# EAGLE design abqmmf2018 (EAGLE 7.7.0)
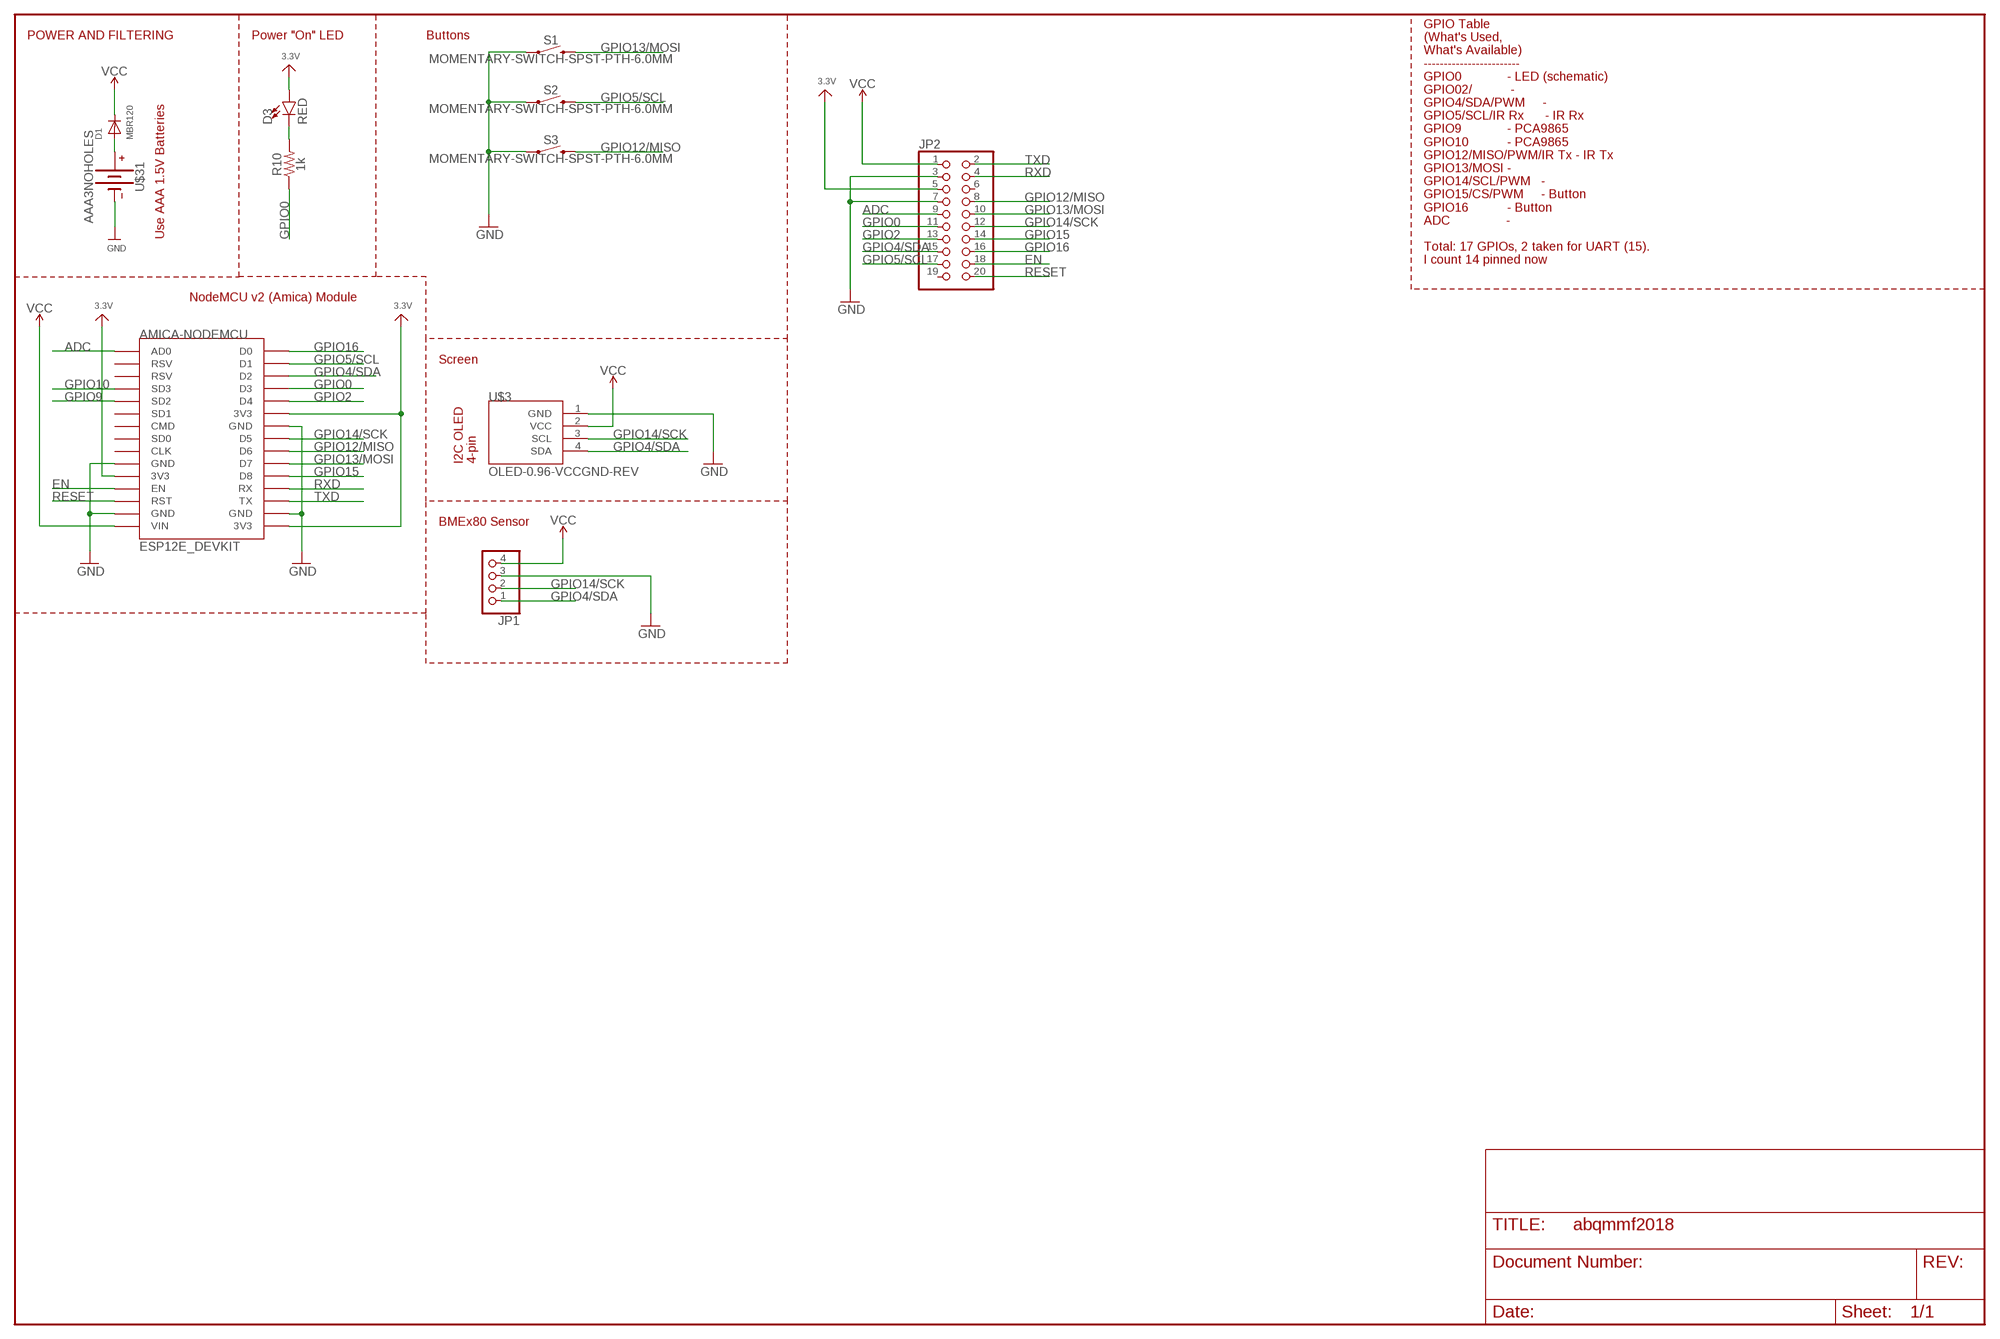
[diagram p0: schematic, sheet 1]

## Parts
AMICA-NODEMCU  ESP12E_DEVKIT  [ESP12E_DEVKIT]
D1  MBR120  DIODEDO-1N4148  [DO-1N4148]
D3  RED  LED5MM  [LED_5MM]
JP1  PINHD-1X4  [1X04]
JP2  PINHD-2X10  [2X10]
R10  1k  1KOHM-HORIZ-1/4W-1%  [AXIAL-0.3]
S1  MOMENTARY-SWITCH-SPST-PTH-6.0MM  [TACTILE_SWITCH_PTH_6.0MM]
S2  MOMENTARY-SWITCH-SPST-PTH-6.0MM  [TACTILE_SWITCH_PTH_6.0MM]
S3  MOMENTARY-SWITCH-SPST-PTH-6.0MM  [TACTILE_SWITCH_PTH_6.0MM]
U$3  OLED-0.96-VCCGND-REV  [OLED-I2C-4PIN-VCCGND-REV]
U$31  AAA3NOHOLES  [AAA3-NOHOLES]

## Nets
3.3V: AMICA-NODEMCU.3V3@0(3V3) AMICA-NODEMCU.3V3@1(3V3) AMICA-NODEMCU.3V3@2(3V3) D3.A JP2.5
ADC: AMICA-NODEMCU.AD0 JP2.9
EN: AMICA-NODEMCU.EN JP2.18
GND: AMICA-NODEMCU.GND@0(GND) AMICA-NODEMCU.GND@1(GND) AMICA-NODEMCU.GND@2(GND) AMICA-NODEMCU.GND@3(GND) JP1.3 JP2.3 JP2.7 S1.1 S2.1 S3.1 U$3.1(GND) U$31.NEG(-)
GPIO0: AMICA-NODEMCU.D3 JP2.11 R10.P$1
GPIO2: AMICA-NODEMCU.D4 JP2.13
GPIO4/SDA: AMICA-NODEMCU.D2 JP1.1 JP2.15 U$3.4(SDA)
GPIO5/SCL: AMICA-NODEMCU.D1 JP2.17 S2.3
GPIO9: AMICA-NODEMCU.SD2
GPIO10: AMICA-NODEMCU.SD3
GPIO12/MISO: AMICA-NODEMCU.D6 JP2.8 S3.3
GPIO13/MOSI: AMICA-NODEMCU.D7 JP2.10 S1.3
GPIO14/SCK: AMICA-NODEMCU.D5 JP1.2 JP2.12 U$3.3(SCL)
GPIO15: AMICA-NODEMCU.D8 JP2.14
GPIO16: AMICA-NODEMCU.D0 JP2.16
N$1: D1.A U$31.POS(+)
N$5: D3.K(C) R10.P$2
RESET: AMICA-NODEMCU.RST JP2.20
RXD: AMICA-NODEMCU.RX JP2.4
TXD: AMICA-NODEMCU.TX JP2.2
VCC: AMICA-NODEMCU.VIN D1.C JP1.4 JP2.1 U$3.2(VCC)
Unconnected: AMICA-NODEMCU.CLK AMICA-NODEMCU.CMD AMICA-NODEMCU.RSV@0(RSV) AMICA-NODEMCU.RSV@1(RSV) AMICA-NODEMCU.SD0 AMICA-NODEMCU.SD1 JP2.6 JP2.19

## Notes on the sheet
- POWER AND FILTERING | Power "On" LED | Buttons
- Use AAA 1.5V Batteries
- GPIO Table
  (What's Used,
  What's Available)
  ------------------------
  GPIO0             - LED (schematic)
  GPIO02/           - 
  GPIO4/SDA/PWM     -
  GPIO5/SCL/IR Rx      - IR Rx
  GPIO9             - PCA9865
  GPIO10           - PCA9865
  GPIO12/MISO/PWM/IR Tx - IR Tx
  GPIO13/MOSI - 
  GPIO14/SCL/PWM   - 
  GPIO15/CS/PWM     - Button
  GPIO16           - Button
  ADC                -
  
  Total: 17 GPIOs, 2 taken for UART (15). 
  I count 14 pinned now
- NodeMCU v2 (Amica) Module
- Screen
- BMEx80 Sensor

## Library data of the parts
AMICA-NODEMCU = ESP12E_DEVKIT:ESP12E_DEVKIT: ESP12E DEVKIT BOARD
D1 = adafruit:DIODE: Diode SMADIODE - SMA Surface Mount Package 20V 1A Schottky Diode Digikey: 641-1014-6-ND DO-1N4148 - Through Hole Small Current Diode SOD-123 20V 1 A (.5mV Vf) Schottky Diode - Digikey: MBRX120TPMSCT-ND SOD-323 10V 570mA (.38mV Vf, 3ns) Schottky Diode - Digikey: ZLLS410CT-ND SOD-523 30V 30mA Schottky Diode (RB751S-40TE61) - Digikey: RB751S-40TE61CT-ND SOT23-R/W - SOT23 Package (R = Solder Paste/Reflow Ovens, W = Hand-Soldering) BAT54Film 40V 300mA - Digikey: 497-7162-1-ND
D3 = SparkFun-LED:LED: LED (Generic) Standard schematic elements and footprints for 5mm, 3mm, 1206, and 0603 sized LEDs. Generic LEDs with no color specified.
JP1 = pinhead:PINHD-1X4: PIN HEADER
JP2 = pinhead:PINHD-2X10: PIN HEADER
R10 = SparkFun-Resistors:1KOHM: 1kΩ resistor A resistor is a passive two-terminal electrical component that implements electrical resistance as a circuit element. Resistors act to reduce current flow, and, at the same time, act to lower voltage levels within circuits. - Wikipedia; PROD_ID: RES-12182
S1-S3 = SparkFun-Switches:MOMENTARY-SWITCH-SPST: Momentary Switch (Pushbutton) - SPST Normally-open (NO) SPST momentary switches (buttons, pushbuttons). Variants PTH-12MM - 12mm square, through-hole Momentary Pushbutton Switch - 12mm Square <https://www.sparkfun.com/products/9190> (COM-09190) PTH-6.0MM, PTH-6.0MM-KIT - 6.0mm square, through-hole Mini Pushbutton Switch <https://www.sparkfun.com/products/97> (COM-00097) KIT package intended for soldering kit's - only one side of pads' copper is exposed. PTH-RIGHT-ANGLE-KIT - Right-angle, through-hole Right Angle Tactile Button <https://www.sparkfun.com/products/10791> - Used on SparkFun BigTime Watch Kit <https://www.sparkfun.com/products/11734> SMD-12MM - 12mm square, surface-mount Tactile Button - SMD (12mm) <https://www.sparkfun.com/products/12993> (COM-12993) Used on SparkFun PicoBoard <https://www.sparkfun.com/products/11888> SMD-4.5MM - 4.5mm Square Trackball Switch Used on SparkFun Blackberry Trackballer Breakout <https://www.sparkfun.com/products/13169> SMD-4.6MMX2.8MM - 4.60mm x 2.80mm, surface mount Used on SparkFun SAMD21 Mini Breakout <https://www.sparkfun.com/products/13664> SMD-5.2MM, SMD-5.2-REDUNDANT - 5.2mm square, surface-mount Mini Pushbutton Switch - SMD <https://www.sparkfun.com/products/8720> (COM-08720) Used on Arduino Pro Mini <https://www.sparkfun.com/products/11114> REDUNDANT package connects both switch circuits together SMD-6.0X3.5MM - 6.0 x 3.5mm, surface mount Momentary Reset Switch SMD <https://www.sparkfun.com/products/8229> (COM-08229) SMD-6.2MM-TALL - 6.2mm square, surface mount Tactile Button - SMD (6mm) <https://www.sparkfun.com/products/12992> Used on SparkFun Digital Sandbox <https://www.sparkfun.com/products/12651> SMD-RIGHT-ANGLE - Right-angle, surface mount Used on SparkFun Block for Intel® Edison - Arduino <https://www.sparkfun.com/products/13036>; PROD_ID: SWCH-08441; SF_SKU: COM-00097
U$3 = Warthog9-Screens:OLED-0.96-VCCGND-REV: Common 0.96 OLED screen assembly
U$31 = Warthog9-Batteries:AAA3

## Board
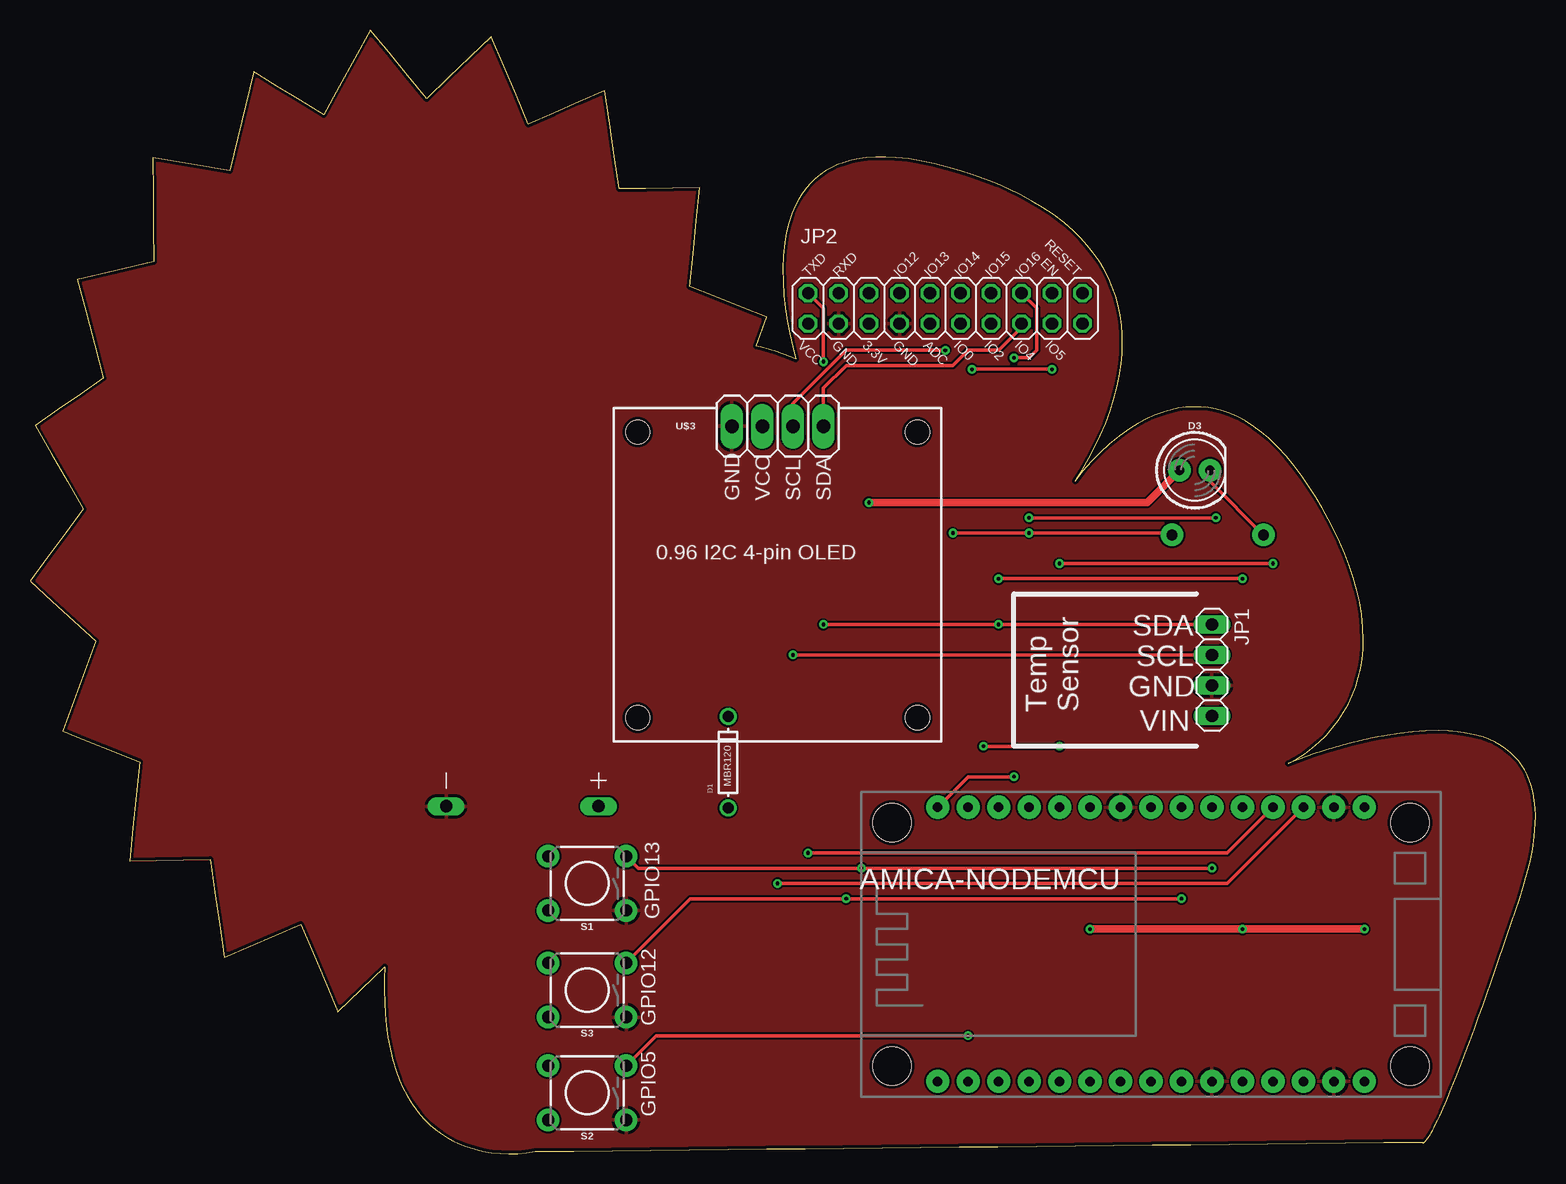
[diagram p1: board, top side]
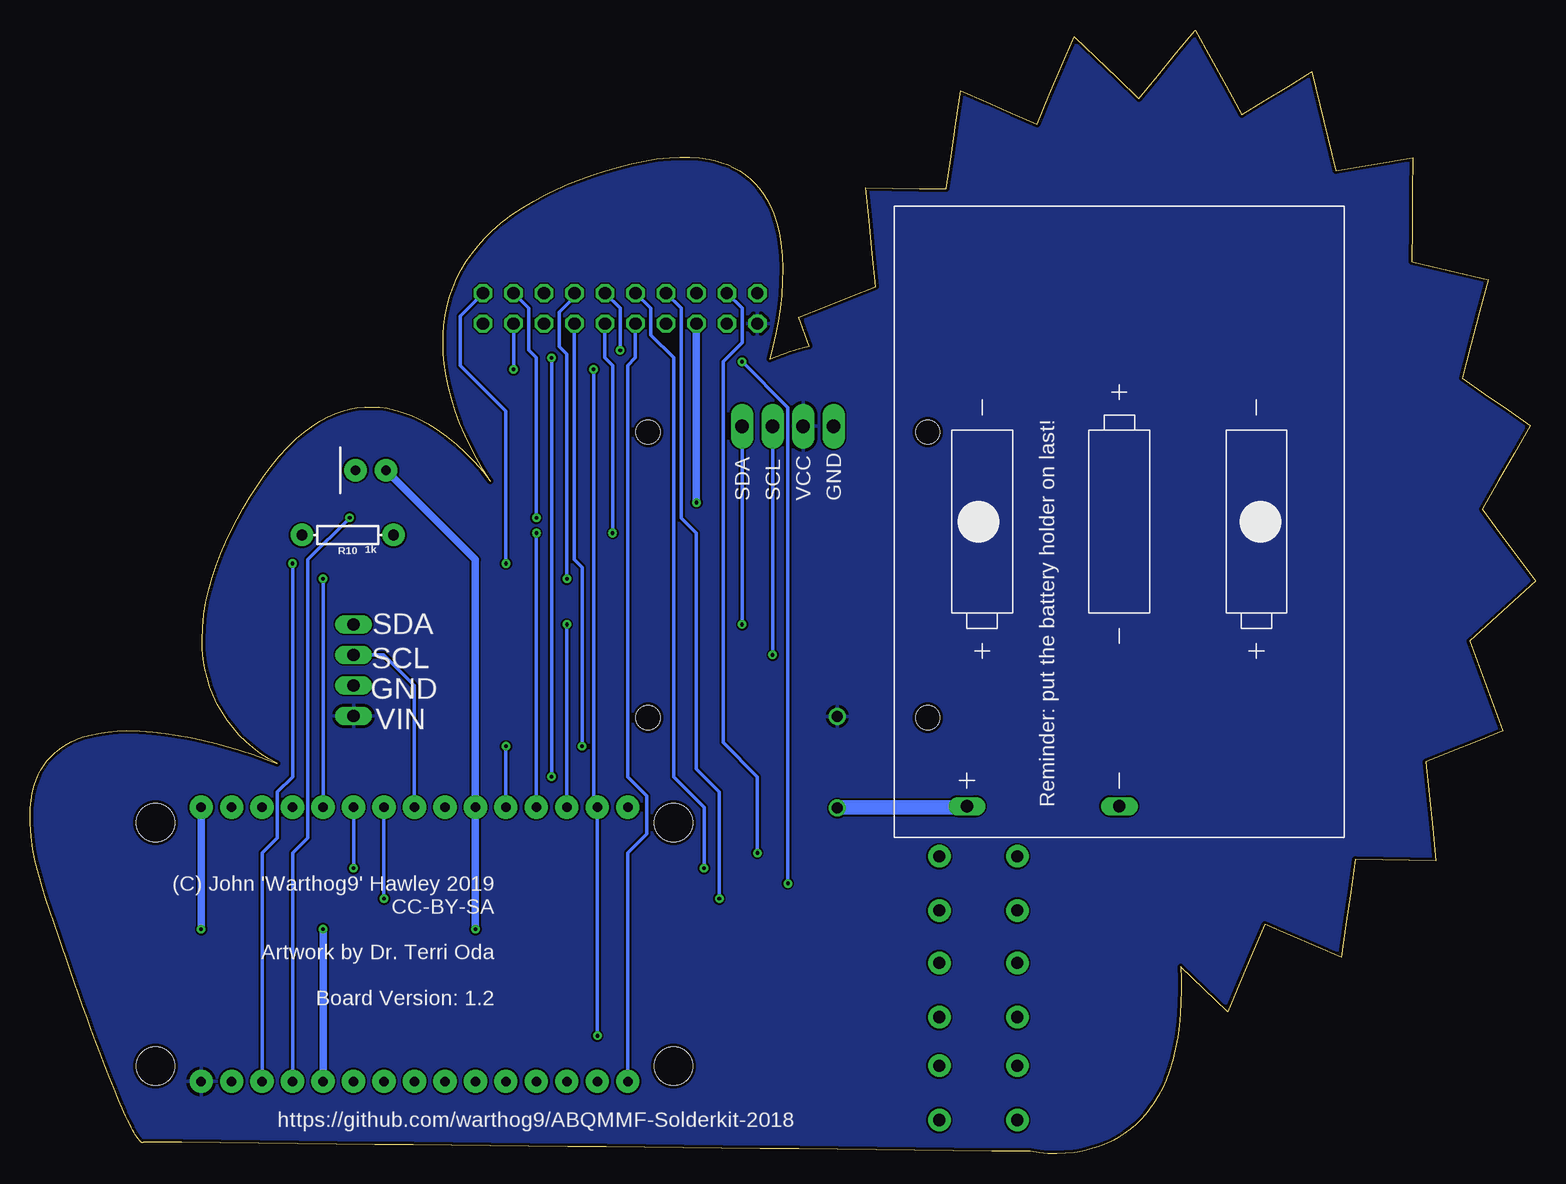
[diagram p2: board, bottom side, seen from below]

Size 125.46 x 93.69 mm. Coordinates in mm from the lower left corner, seen from the top.
Outline: 28.36,93.69 27.06,91.34 25.77,88.99 24.47,86.64 22.53,87.83 20.58,89.02 18.63,90.21 17.97,87.45 17.3,84.7 16.63,81.95 13.43,82.49 10.22,83.03 10.25,80.15 10.28,77.27 10.3,74.39 7.13,73.62 3.95,72.86 4.67,70.13 5.39,67.4 6.1,64.68 4.21,63.35 2.32,62.03 0.43,60.7 1.77,58.39 3.11,56.08 4.45,53.77 2.96,51.76 1.48,49.75 0,47.74 1.83,46.07 3.66,44.41 5.49,42.74 4.56,40.24 3.64,37.74 2.71,35.24 4.85,34.38 6.99,33.53 9.13,32.67 8.85,29.92 8.57,27.18 8.29,24.43 10.54,24.46 12.78,24.5 15.02,24.53 15.41,21.81 15.81,19.09 16.2,16.37 18.33,17.29 20.45,18.21 22.58,19.14 23.61,16.7 24.64,14.27 25.67,11.84 27.62,13.71 29.56,15.57 arc5 29.54,12.64 arc7 29.83,9.71 arc10 30.53,6.87 arc14 31.8,4.23 arc18 33.75,2.05 arc19 36.31,0.63 arc16 39.17,0.03 arc15 42.1,0.2 45.31,0.23 48.53,0.26 51.74,0.3 54.95,0.33 58.17,0.37 61.38,0.4 64.6,0.43 67.81,0.47 71.02,0.5 74.24,0.53 77.45,0.57 80.66,0.6 83.88,0.64 87.09,0.67 90.31,0.7 93.52,0.74 96.73,0.77 99.95,0.81 103.16,0.84 106.37,0.87 109.59,0.91 112.8,0.94 116.02,0.98 116.02,0.97 116.02,0.96 116.03,0.95 116.04,0.94 116.05,0.93 116.07,0.92 116.09,0.92 116.12,0.92 116.15,0.94 116.19,0.96 116.24,1 116.29,1.05 116.35,1.11 116.42,1.2 116.49,1.31 116.58,1.43 116.67,1.59 116.78,1.77 116.89,1.97 117.02,2.21 117.15,2.48 117.3,2.79 117.46,3.13 117.63,3.5 arc3 118.84,6.41 arc1 119.97,9.35 arc1 121.05,12.31 122.1,15.27 123.12,18.25 124.13,21.23 arc6 125,24.34 arc10 125.44,27.53 arc19 125.1,30.72 arc32 123.42,33.43 arc27 120.57,34.89 arc14 117.38,35.28 arc8 114.16,35.06 arc5 111,34.46 arc4 107.89,33.61 arc5 104.84,32.53 arc17 107.44,34.34 arc16 109.46,36.78 arc17 110.7,39.69 arc15 111.11,42.83 arc12 110.79,45.99 arc9 109.93,49.04 arc6 108.67,51.96 arc5 107.14,54.74 arc7 105.36,57.35 arc10 103.22,59.67 arc16 100.61,61.44 arc22 97.58,62.26 arc22 94.46,61.85 arc15 91.63,60.46 arc11 89.18,58.48 arc10 87.09,56.1 arc9 88.74,58.91 arc8 90,61.91 arc9 90.81,65.05 arc12 91.03,68.3 arc15 90.48,71.49 arc16 89.09,74.43 arc14 86.99,76.9 arc11 84.41,78.88 arc8 81.55,80.43 arc6 78.52,81.62 arc6 75.37,82.54 arc9 72.13,83.06 arc15 68.86,82.91 arc26 65.86,81.64 arc28 63.81,79.11 arc18 62.9,75.97 arc10 62.76,72.7 arc7 63.11,69.44 arc7 63.83,66.23 arc6 62.2,66.86 arc5 60.51,67.35 61.4,69.74 59.26,70.6 57.12,71.45 54.98,72.31 55.26,75.06 55.54,77.8 55.82,80.55 53.57,80.52 51.33,80.48 49.09,80.45 48.7,83.17 48.3,85.89 47.91,88.61 45.78,87.69 43.66,86.77 41.54,85.84 40.51,88.28 39.48,90.71 38.45,93.14 36.65,91.42 34.85,89.7 33.05,87.98 31.49,89.88 29.92,91.79 28.36,93.69
Copper layers (1*16): Top 0.035mm / dielectric 1.5mm / Bottom 0.035mm
Design rules "default *": minimum track width 6mil, minimum drill 12mil, track to track 6mil, track to pad 6mil, pad to pad 6mil, via to via 6mil, smd to smd 6mil, copper to edge 10mil, drill to drill 8mil, minimum pad ring 10mil, minimum via ring 8mil, stop-mask expansion 4mil, vias tented up to drill 0mil, thermal gap 10mil

### Footprints (pad centres in the part's own frame; a part is rotated, then mirrored left to right if it is on the bottom)
ESP12E_DEVKIT = drill 0.8 pad 1.93: 3V3@0 -11.43,-7.62; 3V3@1 11.43,5.08; 3V3@2 11.43,-17.78; AD0 -11.43,17.78; CLK -11.43,-2.54; CMD -11.43,2.54; D0 11.43,17.78; D1 11.43,15.24; D2 11.43,12.7; D3 11.43,10.16; D4 11.43,7.62; D5 11.43,0; D6 11.43,-2.54; D7 11.43,-5.08; D8 11.43,-7.62; EN -11.43,-10.16; GND@0 -11.43,-5.08; GND@1 -11.43,-15.24; GND@2 11.43,2.54; GND@3 11.43,-15.24; RST -11.43,-12.7; RSV@0 -11.43,15.24; RSV@1 -11.43,12.7; RX 11.43,-10.16; SD0 -11.43,0; SD1 -11.43,5.08; SD2 -11.43,7.62; SD3 -11.43,10.16; TX 11.43,-12.7; VIN -11.43,-17.78 | hole 3.2: -10.16,21.59; 10.16,21.59; 10.16,-21.59; -10.16,-21.59
DO-1N4148 = drill 0.9: A -3.81,0; C 3.81,0
LED_5MM = drill 0.813 pad 1.88: A -1.27,0; K 1.27,0
1X04 = drill 1.016 long: 1 -3.81,0; 2 -1.27,0; 3 1.27,0; 4 3.81,0
2X10 = drill 1.016 octagon: 1 -11.43,-1.27; 2 -11.43,1.27; 3 -8.89,-1.27; 4 -8.89,1.27; 5 -6.35,-1.27; 6 -6.35,1.27; 7 -3.81,-1.27; 8 -3.81,1.27; 9 -1.27,-1.27; 10 -1.27,1.27; 11 1.27,-1.27; 12 1.27,1.27; 13 3.81,-1.27; 14 3.81,1.27; 15 6.35,-1.27; 16 6.35,1.27; 17 8.89,-1.27; 18 8.89,1.27; 19 11.43,-1.27; 20 11.43,1.27
AXIAL-0.3 = drill 0.9 pad 1.88: P$1 -3.81,0; P$2 3.81,0
TACTILE_SWITCH_PTH_6.0MM = drill 1.016 pad 1.88: 1 -3.251,2.261; 2 3.251,2.261; 3 -3.251,-2.261; 4 3.251,-2.261
OLED-I2C-4PIN-VCCGND-REV = drill 1.118 pad 1.88 long: 1 -3.81,12.4; 2 -1.27,12.4; 3 1.27,12.4; 4 3.81,12.4 | hole 2: -11.65,11.9; 11.65,11.9; -11.65,-11.9; 11.65,-11.9
AAA3-NOHOLES = drill 1.029 long: NEG 23.724,0; POS 23.724,-12.7

### Placement (x,y rotation side)
AMICA-NODEMCU  93.42,17.46 90 top
D1  58.18,32.64 90 top
D3  97.07,56.99 0 top
JP1  98.5,40.32 270 top
JP2  76.27,70.48 0 top
R10  98.97,51.59 180 bottom
S1  46.43,22.54 180 top
S2  46.43,5.08 180 top
S3  46.43,13.65 180 top
U$3  62.3,48.26 0 top
U$31  34.68,52.7 270 bottom

### Tracks (layer width: path | path; a pad name or v marks a point on that pad's centre or on a via)
3.3V  (via drill 0.3)
  Top 0.61: v111.2,18.73 v101.04,18.73 v88.34,18.73 | v69.92,54.29 93.1,54.29 D3.A
  Bottom 0.61: AMICA-NODEMCU.3V3@2 v111.2,18.73 | v101.04,18.73 AMICA-NODEMCU.3V3@0 | v88.34,18.73 AMICA-NODEMCU.3V3@1 88.34,49.53 D3.A | JP2.5 v69.92,54.29
ADC
  Bottom 0.305: AMICA-NODEMCU.AD0 75.64,25.08 74.05,26.67 74.05,29.85 75.64,31.43 75.64,65.72 75,66.36 JP2.9
EN  (via drill 0.3)
  Top 0.305: v83.26,53.02 v98.82,53.02
  Bottom 0.305: AMICA-NODEMCU.EN 103.58,25.08 102.31,26.35 102.31,49.53 v98.82,53.02 | v83.26,53.02 83.26,66.36 83.89,66.99 83.89,70.48 JP2.18
GND
  pour Top: -0.56,-0.32 127.71,-0.32 128.98,94.93 -0.56,94.93
GPIO0  (via drill 0.3)
  Top 0.305: R10.P$1 95.01,51.75 v83.26,51.75 v76.91,51.75
  Bottom 0.305: JP2.11 77.54,66.36 76.91,65.72 v76.91,51.75 | AMICA-NODEMCU.D3 v83.26,51.75
GPIO2  (via drill 0.3)
  Top 0.305: v79.45,33.97 v85.8,33.97
  Bottom 0.305: v85.8,33.97 AMICA-NODEMCU.D4 | v79.45,33.97 79.45,48.89 80.08,49.53 JP2.13
GPIO4/SDA  (via drill 0.3)
  Top 0.305: JP2.15 82.62,68.9 80.72,66.99 78.18,66.99 76.91,65.72 68.02,65.72 66.11,63.82 U$3.4 | v66.11,44.13 v80.72,44.13 JP1.1
  Bottom 0.305: v80.72,44.13 AMICA-NODEMCU.D2 | v66.11,44.13 U$3.4
GPIO5/SCL  (via drill 0.3)
  Top 0.305: v85.16,65.4 v78.5,65.4 | S2.3 52.18,9.84 v78.18,9.84
  Bottom 0.305: JP2.17 v85.16,65.4 | v78.5,65.4 78.5,29.21 AMICA-NODEMCU.D1 v78.18,9.84
GPIO12/MISO  (via drill 0.3)
  Top 0.305: S3.3 55.04,21.27 v68.02,21.27 v95.96,21.27
  Bottom 0.305: JP2.8 71.19,70.48 71.19,53.02 69.92,51.75 69.92,32.07 68.02,30.16 v68.02,21.27 | AMICA-NODEMCU.D6 v95.96,21.27
GPIO13/MOSI  (via drill 0.3)
  Top 0.305: v98.5,23.81 v69.29,23.81 50.67,23.81 S1.3
  Bottom 0.305: JP2.10 73.73,70.48 73.73,68.26 71.83,66.36 71.83,31.43 69.29,28.89 v69.29,23.81 | AMICA-NODEMCU.D7 v98.5,23.81
GPIO14/SCK  (via drill 0.3)
  Top 0.305: v76.27,66.99 68.02,66.99 63.57,62.55 U$3.3 | v63.57,41.59 JP1.2
  Bottom 0.305: v76.27,66.99 76.27,70.48 JP2.12 | v63.57,41.59 U$3.3 | AMICA-NODEMCU.D5 93.42,39.05 95.96,41.59 JP1.2
GPIO15  (via drill 0.3)
  Top 0.305: v80.72,47.94 v101.04,47.94
  Bottom 0.305: JP2.14 80.08,71.44 81.35,70.17 81.35,67.31 80.72,66.68 v80.72,47.94 | v101.04,47.94 AMICA-NODEMCU.D8
GPIO16  (via drill 0.3)
  Top 0.305: JP2.16 83.89,70.48 83.89,66.99 83.26,66.36 v81.99,66.36 | AMICA-NODEMCU.D0 78.18,31.43 v81.99,31.43
  Bottom 0.305: v81.99,66.36 v81.99,31.43
N$1
  Bottom 0.305: U$31.POS 47.47,28.89
  Bottom 1.27: 47.47,28.89 D1.A
N$5
  Top 0.305: D3.K 98.34,56.04 R10.P$2
RESET  (via drill 0.3)
  Top 0.305: v103.58,49.21 v85.8,49.21
  Bottom 0.305: AMICA-NODEMCU.RST 106.12,25.08 104.85,26.35 104.85,30.16 103.58,31.43 v103.58,49.21 | v85.8,49.21 85.8,61.91 89.61,65.72 89.61,69.85 JP2.20
RXD  (via drill 0.3)
  Top 0.305: v64.84,25.08 99.77,25.08 AMICA-NODEMCU.RX
  Bottom 0.305: JP2.4 66.11,70.48 66.11,67.63 67.7,66.04 67.7,34.29 64.84,31.43 v64.84,25.08
TXD  (via drill 0.3)
  Top 0.305: JP2.2 66.11,70.48 v66.11,66.04 | v62.3,22.54 99.77,22.54 AMICA-NODEMCU.TX
  Bottom 0.305: v62.3,22.54 62.3,62.23 v66.11,66.04
VCC
  pour Bottom (rank 6): -0.56,-0.32 127.71,-0.32 128.98,94.93 -0.56,94.93

### Text on the board
tPlace: EN | RESET | TXD | RXD | IO12 | IO13 | IO14 | IO15 | IO16 | VCC | GND | 3.3V | GND | ADC | IO0 | IO2 | IO4 | IO5 | SDA | SCL | GND | Temp / Sensor | VIN | GPIO13 | GPIO12 | GPIO5
bPlace: SDA | SCL | GND | VIN | Reminder: put the battery holder on last! | (C) John 'Warthog9' Hawley 2019 / CC-BY-SA / / Artwork by Dr. Terri Oda / / Board Version: 1.2 | https://github.com/warthog9/ABQMMF-Solderkit-2018